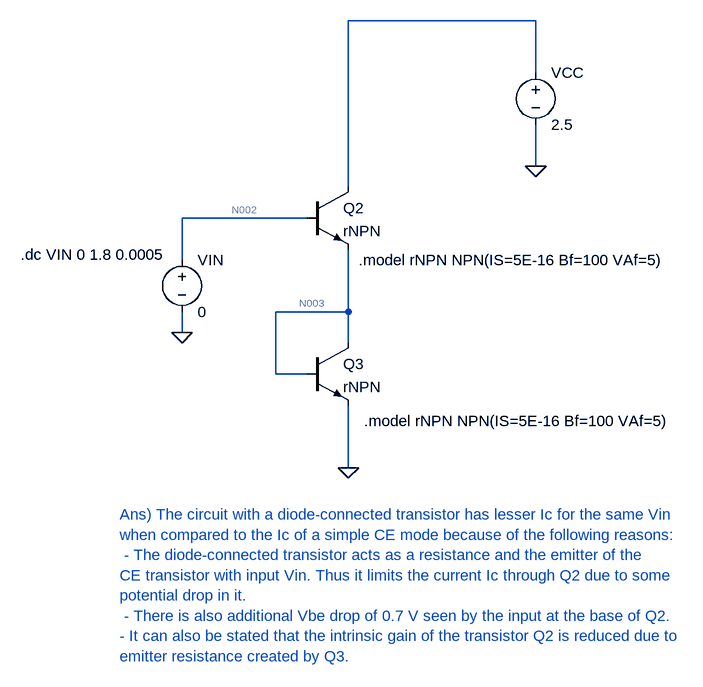
[diagram p0: schematic 4_59_b.asc]
4_59_b.asc, the LTspice schematic file:
Version 4
SHEET 1 1664 680
WIRE 400 -368 112 -368
WIRE 400 -288 400 -368
WIRE 400 -144 400 -208
WIRE 112 -112 112 -368
WIRE 48 -64 -144 -64
WIRE -144 0 -144 -64
WIRE 112 80 112 -16
WIRE 112 80 0 80
WIRE -144 112 -144 80
WIRE 112 128 112 80
WIRE 0 176 0 80
WIRE 48 176 0 176
WIRE 112 320 112 224
FLAG 112 320 0
FLAG 400 -144 0
FLAG -144 112 0
SYMBOL npn 48 -112 R0
SYMATTR InstName Q2
SYMATTR Value rNPN
SYMBOL npn 48 128 R0
SYMATTR InstName Q3
SYMATTR Value rNPN
SYMBOL voltage 400 -304 R0
SYMATTR InstName VCC
SYMATTR Value 2.5
SYMBOL voltage -144 -16 R0
SYMATTR InstName VIN
SYMATTR Value 0
TEXT 136 248 Left 2 !.model rNPN NPN(IS=5E-16 Bf=100 VAf=5)
TEXT 128 0 Left 2 !.model rNPN NPN(IS=5E-16 Bf=100 VAf=5)
TEXT -392 -8 Left 2 !.dc VIN 0 1.8 0.0005
TEXT -240 392 Left 2 ;Ans) The circuit with a diode-connected transistor has lesser Ic for the same Vin \nwhen compared to the Ic of a simple CE mode because of the following reasons:\n - The diode-connected transistor acts as a resistance and the emitter of the \nCE transistor with input Vin. Thus it limits the current Ic through Q2 due to some\npotential drop in it. \n - There is also additional Vbe drop of 0.7 V seen by the input at the base of Q2.\n- It can also be stated that the intrinsic gain of the transistor Q2 is reduced due to\nemitter resistance created by Q3.

The netlist it stands for:
* 4_59_b.asc
Q2 N001 N002 N003 0 rNPN
Q3 N003 N003 0 0 rNPN
VCC N001 0 2.5
VIN N002 0 0
.model NPN NPN
.model PNP PNP
.lib standard.bjt
.model rNPN NPN(IS=5E-16 Bf=100 VAf=5)
.model rNPN NPN(IS=5E-16 Bf=100 VAf=5)
.dc VIN 0 1.8 0.0005
* Ans) The circuit with a diode-connected transistor has lesser Ic for the same Vin
* when compared to the Ic of a simple CE mode because of the following reasons:
*  - The diode-connected transistor acts as a resistance and the emitter of the
* CE transistor with input Vin. Thus it limits the current Ic through Q2 due to some
* potential drop in it.
*  - There is also additional Vbe drop of 0.7 V seen by the input at the base of Q2.
* - It can also be stated that the intrinsic gain of the transistor Q2 is reduced due to
* emitter resistance created by Q3.
.backanno
.end

* Results of the author's LTspice run, read from the files saved beside the schematic
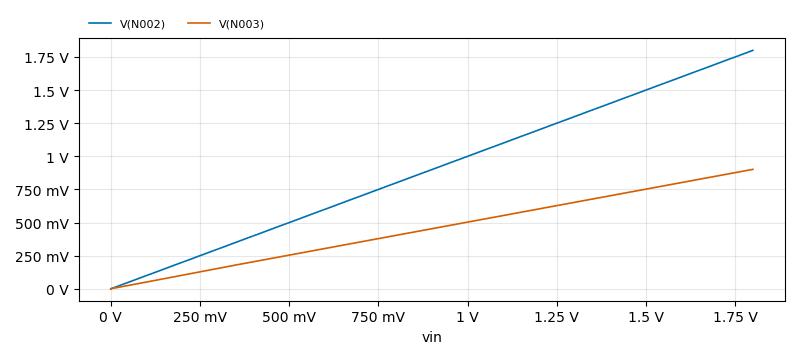
[diagram p1: DC transfer characteristic of 4_59_b.asc, plotted from the saved traces]
* DC transfer characteristic, 1 run:
*   V(N002): 0 V at vin=0 V, 1.8 V at vin=1.8 V, min 0 V, max 1.8 V
*   V(N003): 366.1 µV at vin=0 V, 901.7 mV at vin=1.8 V, min 366.1 µV, max 901.7 mV